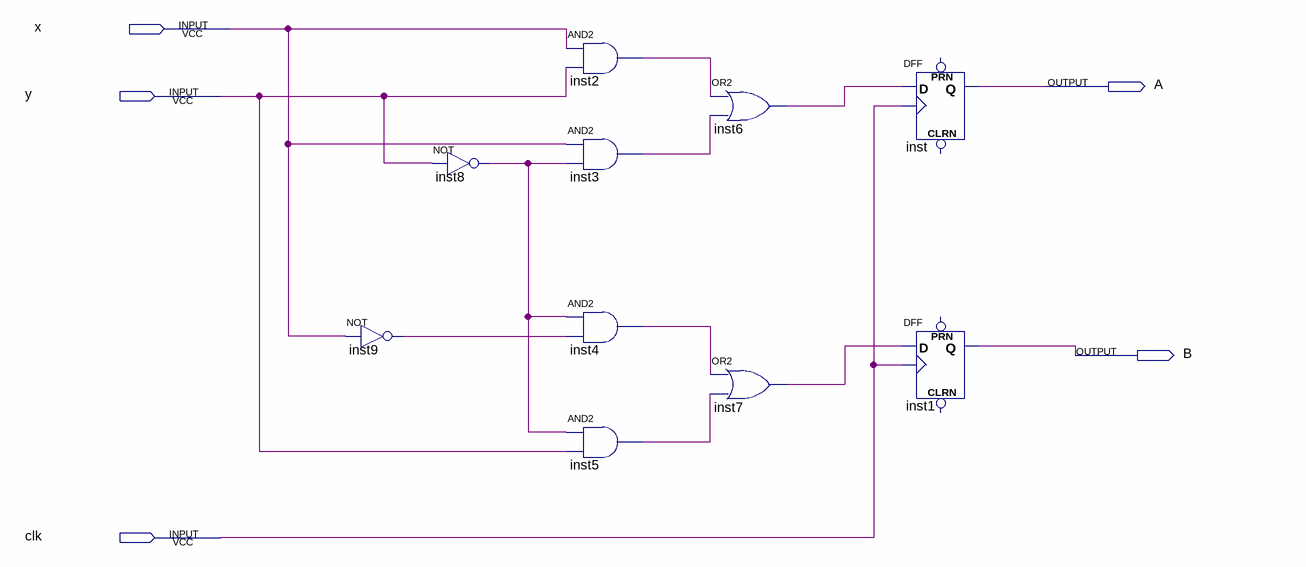
[diagram p0: schematic sheet]
// Quartus schematic ergasia1.bdf as structural Verilog: 10 symbols, 5 pins
module ergasia1 (
  input  x,
  input  y,
  input  clk,
  output A,
  output B
);

  wire inst2_out, inst3_out, inst4_out, inst5_out, inst6_out, inst7_out, inst8_out, inst9_out;

  not inst9 (inst9_out, x);
  not inst8 (inst8_out, y);
  and inst2 (inst2_out, x, y);
  and inst3 (inst3_out, x, inst8_out);
  and inst4 (inst4_out, inst8_out, inst9_out);
  and inst5 (inst5_out, inst8_out, y);
  or inst6 (inst6_out, inst2_out, inst3_out);
  or inst7 (inst7_out, inst4_out, inst5_out);
  DFF inst (.CLK(clk), .D(inst6_out), .Q(A));  // open: CLRN, PRN
  DFF inst1 (.CLK(clk), .D(inst7_out), .Q(B));  // open: CLRN, PRN
endmodule
